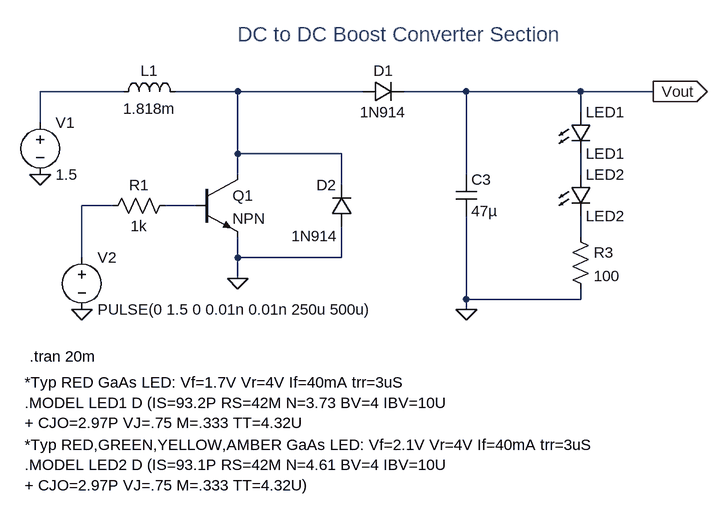
[diagram p0: schematic simple_dc-dc_booster_circuit_ltspice.asc]
simple_dc-dc_booster_circuit_ltspice.asc, the LTspice schematic file:
Version 4
SHEET 1 1072 712
WIRE 48 96 -80 96
WIRE 224 96 128 96
WIRE 416 96 224 96
WIRE 576 96 480 96
WIRE 752 96 576 96
WIRE 864 96 752 96
WIRE 752 128 752 96
WIRE -80 144 -80 96
WIRE 224 192 224 96
WIRE 384 192 224 192
WIRE 224 224 224 192
WIRE 576 224 576 96
WIRE 752 224 752 192
WIRE 384 240 384 192
WIRE 32 272 -16 272
WIRE 160 272 112 272
WIRE 752 320 752 288
WIRE -16 352 -16 272
WIRE 224 352 224 320
WIRE 384 352 384 304
WIRE 384 352 224 352
WIRE 224 384 224 352
WIRE 576 416 576 288
WIRE 752 416 752 400
WIRE 752 416 576 416
WIRE 576 432 576 416
FLAG -80 224 0
FLAG 864 96 Vout
IOPIN 864 96 Out
FLAG 224 384 0
FLAG 576 432 0
FLAG -16 432 0
SYMBOL ind 32 112 R270
WINDOW 0 32 56 VTop 2
WINDOW 3 5 56 VBottom 2
SYMATTR InstName L1
SYMATTR Value 1.818m
SYMBOL diode 416 112 R270
WINDOW 0 32 32 VTop 2
WINDOW 3 0 32 VBottom 2
SYMATTR InstName D1
SYMATTR Value 1N914
SYMBOL diode 400 304 R180
WINDOW 0 24 64 Left 2
WINDOW 3 22 -15 Left 2
SYMATTR InstName D2
SYMATTR Value 1N914
SYMBOL voltage -80 128 R0
SYMATTR InstName V1
SYMATTR Value 1.5
SYMBOL cap 560 224 R0
SYMATTR InstName C3
SYMATTR Value 47µ
SYMBOL res 736 304 R0
SYMATTR InstName R3
SYMATTR Value 100
SYMBOL LED 736 224 R0
SYMATTR InstName LED2
SYMATTR Value LED2
SYMBOL LED 736 128 R0
SYMATTR InstName LED1
SYMATTR Value LED1
SYMBOL voltage -16 336 R0
WINDOW 123 0 0 Left 0
WINDOW 39 0 0 Left 0
SYMATTR InstName V2
SYMATTR Value PULSE(0 1.5 0 0.01n 0.01n 250u 500u)
SYMBOL res 128 256 R90
WINDOW 0 0 56 VBottom 2
WINDOW 3 32 56 VTop 2
SYMATTR InstName R1
SYMATTR Value 1k
SYMBOL npn 160 224 R0
SYMATTR InstName Q1
TEXT 224 8 Left 3 ;DC to DC Boost Converter Section
TEXT -96 504 Left 2 !.tran 20m
TEXT -104 544 Left 2 !*Typ RED GaAs LED: Vf=1.7V Vr=4V If=40mA trr=3uS\n.MODEL LED1 D (IS=93.2P RS=42M N=3.73 BV=4 IBV=10U\n+ CJO=2.97P VJ=.75 M=.333 TT=4.32U
TEXT -104 640 Left 2 !*Typ RED,GREEN,YELLOW,AMBER GaAs LED: Vf=2.1V Vr=4V If=40mA trr=3uS\n.MODEL LED2 D (IS=93.1P RS=42M N=4.61 BV=4 IBV=10U\n+ CJO=2.97P VJ=.75 M=.333 TT=4.32U)

The netlist it stands for:
* simple_dc-dc_booster_circuit_ltspice.asc
L1 N001 N002 1.818m
D1 N002 Vout 1N914
D2 0 N002 1N914
V1 N001 0 1.5
C3 Vout 0 47µ
R3 N006 0 100
D§LED2 N003 N006 LED2
D§LED1 Vout N003 LED1
V2 N004 0 PULSE(0 1.5 0 0.01n 0.01n 250u 500u)
R1 N005 N004 1k
Q1 N002 N005 0 0 NPN
.model D D
.lib standard.dio
.model NPN NPN
.model PNP PNP
.lib standard.bjt
* DC to DC Boost Converter Section
.tran 20m
*Typ RED GaAs LED: Vf=1.7V Vr=4V If=40mA trr=3uS
.MODEL LED1 D (IS=93.2P RS=42M N=3.73 BV=4 IBV=10U
+ CJO=2.97P VJ=.75 M=.333 TT=4.32U
*Typ RED,GREEN,YELLOW,AMBER GaAs LED: Vf=2.1V Vr=4V If=40mA trr=3uS
.MODEL LED2 D (IS=93.1P RS=42M N=4.61 BV=4 IBV=10U
+ CJO=2.97P VJ=.75 M=.333 TT=4.32U)
.backanno
.end